# EAGLE design ESP32 (EAGLE 9.6.0)
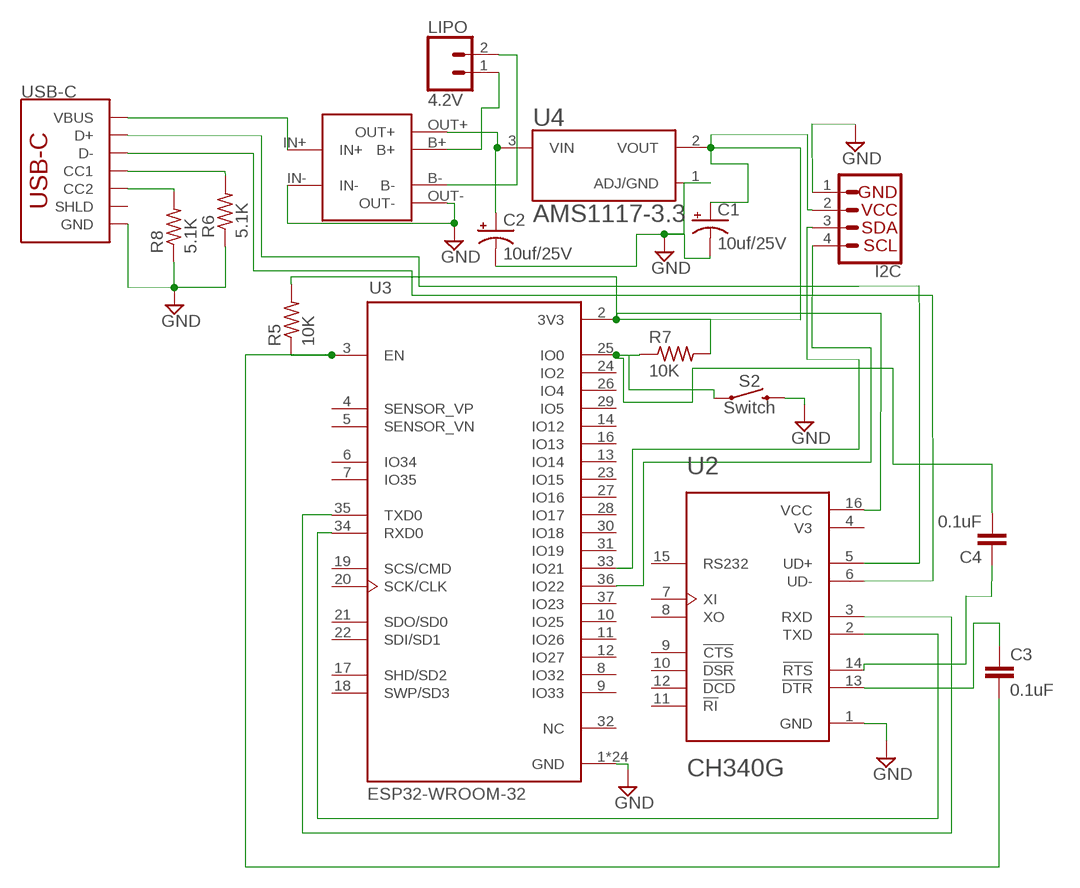
[diagram p0: schematic, sheet 1]

## Parts
C1  10uf/25V  1000UF-RADIAL-5MM-25V-20%-NO-SILK  [CPOL-RADIAL-5MM-10MM-NS]
C2  10uf/25V  1000UF-RADIAL-5MM-25V-20%-NO-SILK  [CPOL-RADIAL-5MM-10MM-NS]
C3  0.1uF  0.1UF-KIT-EZ-50V-20%  [CAP-PTH-SMALL-KIT]
C4  0.1uF  0.1UF-KIT-EZ-50V-20%  [CAP-PTH-SMALL-KIT]
I2C  I2C_STANDARD  [1X04]
LIPO  4.2V  CONN_02  [1X02]
R5  10K  R-US_0204/5  [0204/5]
R6  5.1K  R-US_0204/5  [0204/5]
R7  10K  R-US_0204/5  [0204/5]
R8  5.1K  R-US_0204/5  [0204/5]
S2  Switch  MOMENTARY-SWITCH-SPST-PTH-6.0MM  [TACTILE_SWITCH_PTH_6.0MM]
U1  TP4056  TP4056  [TP4056]
U2  CH340G  [SOIC127P600X180-16N]
U3  ESP32-WROOM-32  [MODULE_ESP32-WROOM-32]
U4  AMS1117-3.3  [SOT229P700X180-4N]
USB-C  USB_C_2-LAYER_PADS  [USB-C-16P-2LAYER-PADS]

## Nets
GND: C1.- C2.- I2C.1 R6.1 R8.1 S2.3 U1.IN- U1.OUT- U2.1(GND) U3.1(GND) U3.15(GND) U3.38(GND) U3.39_1(GND) U3.39_2(GND) U3.39_3(GND) U3.39_4(GND) U3.39_5(GND) U3.39_6(GND) U3.39_7(GND) U3.39_8(GND) U3.39_9(GND) U3.39_10(GND) U3.39_11(GND) U3.39_12(GND) U3.39_13(GND) U3.39_14(GND) U3.39_15(GND) U3.39_16(GND) U3.39_17(GND) U3.39_18(GND) U3.39_19(GND) U3.39_20(GND) U3.39_21(GND) U4.1(ADJ/GND) USB-C.GND USB-C.GND2(GND)
N$1: C1.+ I2C.2 R5.2 R7.2 U2.16(VCC) U3.2(3V3) U4.2(VOUT)
N$2: U1.IN+ USB-C.VBUS1(VBUS) USB-C.VBUS2(VBUS)
N$3: C2.+ U1.OUT+ U4.3(VIN)
N$4: U2.5(UD+) USB-C.A6(D+) USB-C.B6(D+)
N$5: U2.6(UD-) USB-C.A7(D-) USB-C.B7(D-)
N$6: U2.3(RXD) U3.35(TXD0)
N$7: U2.2(TXD) U3.34(RXD0)
N$8: C3.2 R5.1 U3.3(EN)
N$9: C4.2 R7.1 S2.1 U3.25(IO0)
N$10: I2C.3 U3.33(IO21)
N$11: I2C.4 U3.36(IO22)
N$12: C3.1 U2.13(!DTR)
N$13: C4.1 U2.14(!RTS)
N$14: LIPO.1 U1.B+
N$15: LIPO.2 U1.B-
N$16: R6.2 USB-C.A5(CC1)
N$17: R8.2 USB-C.B5(CC2)
Unconnected: U2.7(XI) U2.8(XO) U2.9(!CTS) U2.10(!DSR) U2.11(!RI) U2.12(!DCD) U2.15(RS232) U3.4(SENSOR_VP) U3.5(SENSOR_VN) U3.6(IO34) U3.7(IO35) U3.8(IO32) U3.9(IO33) U3.10(IO25) U3.11(IO26) U3.12(IO27) U3.13(IO14) U3.14(IO12) U3.16(IO13) U3.17(SHD/SD2) U3.18(SWP/SD3) U3.19(SCS/CMD) U3.20(SCK/CLK) U3.21(SDO/SD0) U3.22(SDI/SD1) U3.23(IO15) U3.24(IO2) U3.26(IO4) U3.27(IO16) U3.28(IO17) U3.29(IO5) U3.30(IO18) U3.31(IO19) U3.32(NC) U3.37(IO23) USB-C.SHLD1(SHLD) USB-C.SHLD2(SHLD) USB-C.SHLD3(SHLD) USB-C.SHLD4(SHLD)

## Power pins joined to a net without a drawn wire
V3: U2.4(V3)

## Library data of the parts
C1 C2 = SparkFun-Capacitors:1000UF: 1,000µF/1mF ceramic capacitors A capacitor is a passive two-terminal electrical component used to store electrical energy temporarily in an electric field. CAP-08070; OC_FARNELL: unknown
C3 C4 = SparkFun-Capacitors:0.1UF: 0.1µF ceramic capacitors A capacitor is a passive two-terminal electrical component used to store electrical energy temporarily in an electric field.; MF: VISHAY; MPN: 20VLP10-R; OC_FARNELL: 2860003; PROD_ID: CAP-08370
I2C = SparkFun-Connectors:I2C_STANDARD: SparkFun I2C Standard Pinout Header SparkFun has standardized on a pinout for all I2C based sensor breakouts. This pinout allows I2C boards to be plugged directly into the headers on Arduino Uno compatible boards, and to be daisy chained easily. Example SparkFun Products: SparkFun Atmospheric Sensor Breakout - BME280 <https://www.sparkfun.com/products/13676> SparkFun Altitude/Pressure Sensor Breakout - MPL3115A2 <https://www.sparkfun.com/products/11084> SparkFun TOF Range Finder Sensor - VL6180 <https://www.sparkfun.com/products/12785>; OC_FARNELL: unknown
LIPO = SparkFun-Connectors:CONN_02: Multi connection point. Often used as Generic Header-pin footprint for 0.1 inch spaced/style header connections On any of the 0.1 inch spaced packages, you can populate with these: Break Away Headers - Straight <https://www.sparkfun.com/products/116> (PRT-00116) Break Away Male Headers - Right Angle <https://www.sparkfun.com/products/553> (PRT-00553) Female Headers <https://www.sparkfun.com/products/115> (PRT-00115) Break Away Headers - Machine Pin <https://www.sparkfun.com/products/117> (PRT-00117) Break Away Female Headers - Swiss Machine Pin <https://www.sparkfun.com/products/743> (PRT-00743) For SCREWTERMINALS and SPRING TERMINALS visit here: Screw Terimnals on SparkFun.com <https://www.sparkfun.com/search/results?term=Screw+Terminals> (5mm/3.5mm/2.54mm spacing) This device is also useful as a general connection point to wire up your design to another part of your project. Our various solder wires solder well into these plated through hole pads. Hook-Up Wire - Assortment (Stranded, 22 AWG) <https://www.sparkfun.com/products/11375> (PRT-11375) Hook-Up Wire - Assortment (Solid Core, 22 AWG) <https://www.sparkfun.com/products/11367> (PRT-11367) View the entire wire category on our website here <https://www.sparkfun.com/categories/141> Special notes: Molex polarized connector foot print use with: PRT-08233 with associated crimp pins and housings. 2.54_SCREWTERM for use with PRT-10571. 3.5mm Screw Terminal footprints for PRT-08084 5mm Screw Terminal footprints for use with PRT-08432; OC_FARNELL: unknown
R5 R7 = rcl:R-US_: RESISTOR, American symbol; MF: TT ELECTRONICS / WELWYN; MPN: WP4S-10KRJA2; OC_FARNELL: 1219304; SPICEPREFIX: R
R6 R8 = rcl:R-US_: RESISTOR, American symbol; MF: NEOHM - TE CONNECTIVITY; MPN: LR2F5K1; OC_FARNELL: 2330356; SPICEPREFIX: R
S2 = SparkFun-Switches:MOMENTARY-SWITCH-SPST: Momentary Switch (Pushbutton) - SPST Normally-open (NO) SPST momentary switches (buttons, pushbuttons). Variants PTH-12MM - 12mm square, through-hole Momentary Pushbutton Switch - 12mm Square <https://www.sparkfun.com/products/9190> (COM-09190) PTH-6.0MM, PTH-6.0MM-KIT - 6.0mm square, through-hole Mini Pushbutton Switch <https://www.sparkfun.com/products/97> (COM-00097) KIT package intended for soldering kit's - only one side of pads' copper is exposed. PTH-RIGHT-ANGLE-KIT - Right-angle, through-hole Right Angle Tactile Button <https://www.sparkfun.com/products/10791> - Used on SparkFun BigTime Watch Kit <https://www.sparkfun.com/products/11734> SMD-12MM - 12mm square, surface-mount Tactile Button - SMD (12mm) <https://www.sparkfun.com/products/12993> (COM-12993) Used on SparkFun PicoBoard <https://www.sparkfun.com/products/11888> SMD-4.5MM - 4.5mm Square Trackball Switch Used on SparkFun Blackberry Trackballer Breakout <https://www.sparkfun.com/products/13169> SMD-4.6MMX2.8MM - 4.60mm x 2.80mm, surface mount Used on SparkFun Pro Micro - RP2040 <https://www.sparkfun.com/products/17717> SMD-5.2MM, SMD-5.2-REDUNDANT - 5.2mm square, surface-mount Mini Pushbutton Switch - SMD <https://www.sparkfun.com/products/8720> (COM-08720) Used on Arduino Pro Mini <https://www.sparkfun.com/products/11114> REDUNDANT package connects both switch circuits together SMD-6.0X3.5MM - 6.0 x 3.5mm, surface mount Momentary Reset Switch SMD <https://www.sparkfun.com/products/8229> (COM-08229) SMD-6.2MM-TALL - 6.2mm square, surface mount Tactile Button - SMD (6mm) <https://www.sparkfun.com/products/12992> Used on SparkFun Digital Sandbox <https://www.sparkfun.com/products/12651> SMD-RIGHT-ANGLE - Right-angle, surface mount Used on SparkFun Block for Intel® Edison - Arduino <https://www.sparkfun.com/products/13036>; MF: ALCOSWITCH - TE CONNECTIVITY; MPN: FSM10JH; OC_FARNELL: 1555986; PROD_ID: SWCH-08441; SF_SKU: COM-00097
U1 = 32teeth - TP4056 Module:TP4056; OC_FARNELL: unknown; SPICEPREFIX: X
U2 = CH340G (1):CH340G: Check availability <https://pricing.snapeda.com/parts/Ch340G/WCH/view-part?ref=eda>; AVAILABILITY: Not in stock; CHECK_PRICES: https://www.snapeda.com/parts/Ch340G/WCH/view-part/?ref=eda; DESCRIPTION: USB Interface Integrated Circuit; MF: WCH; MP: Ch340G; OC_FARNELL: unknown; PACKAGE: None; PRICE: None; SNAPEDA_LINK: https://www.snapeda.com/parts/Ch340G/WCH/view-part/?ref=snap
U3 = ESP32-WROOM-32:ESP32-WROOM-32: Check availability <https://pricing.snapeda.com/parts/ESP32-WROOM-32/Espressif%20Systems/view-part?ref=eda>; AVAILABILITY: In Stock; CHECK_PRICES: https://www.snapeda.com/parts/ESP32-WROOM-32/Espressif+Systems/view-part/?ref=eda; DESCRIPTION: Bluetooth, WiFi 802.11b/g/n, Bluetooth v4.2 +EDR, Class 1, 2 and 3 Transceiver Module 2.4GHz ~ 2.5GHz Antenna Not Included, U.FL Surface Mount; MF: DFROBOT; MP: ESP32-WROOM-32; MPN: DFR0654; OC_FARNELL: 4308187; PACKAGE: None; PRICE: None; SNAPEDA_LINK: https://www.snapeda.com/parts/ESP32-WROOM-32/Espressif+Systems/view-part/?ref=snap
U4 = AMS1117-3.3:AMS1117-3.3: Sot223/Pkg 1-Amp 3.3-Volt Low Drop Out Voltage Regulatator; AVAILABILITY: Unavailable; DESCRIPTION: Sot223/Pkg 1-Amp 3.3-Volt Low Drop Out Voltage Regulatator; MF: Advanced Monolithic Systems; MP: AMS1117-3.3; OC_FARNELL: unknown; PACKAGE: None; PRICE: None
USB-C = SparkFun-Connectors:USB_C: USB Type C 16Pin Connector Super Speed pins not available on the 16-pin purely SMD connector so this part is best for USB 2.0 implementations. D1 and D2 are tied together enabling D+/- no matter which way the cable is plugged into the connector. The two channel configuration pins (CC1/2) are exposed. These are normally connected to ground via 5.1k resistors but can be reconfigured for high current/high power applications. **4-LAYER BOARD WARNING!!** If designing 4-layer board, make sure to select the variant _4-LAYER-ISOLATED. The linked footprint (USB-C-16-4LAYER-ISOLATED) includes some very necessary cutout polygons in the inner layers (2 and 15). This prevents the PTH mounting shield legs on the USB connector from electrically connecting any other polygons on the inner layers (usually VCC and GND).; MF: MOLEX; MPN: 105450-0101; OC_FARNELL: 2524076; PROD_ID: CONN-14122

## Board
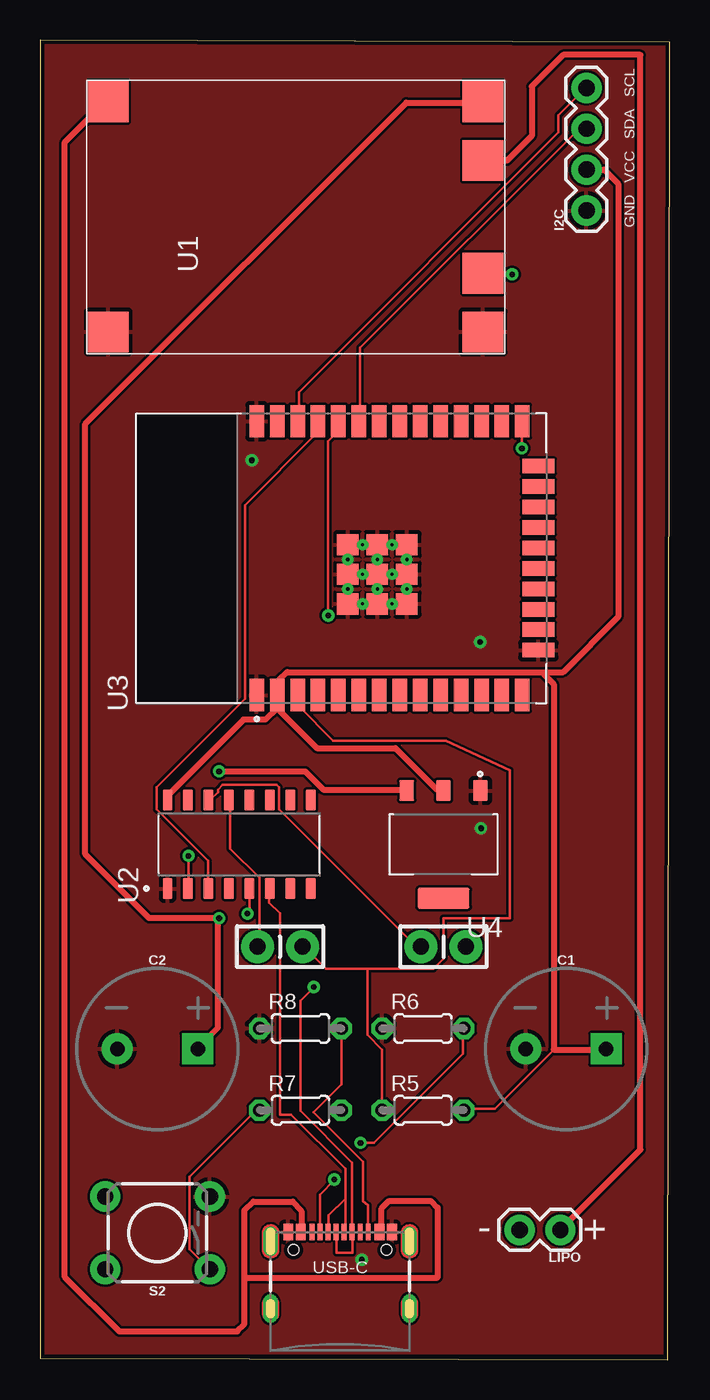
[diagram p1: board, top side]
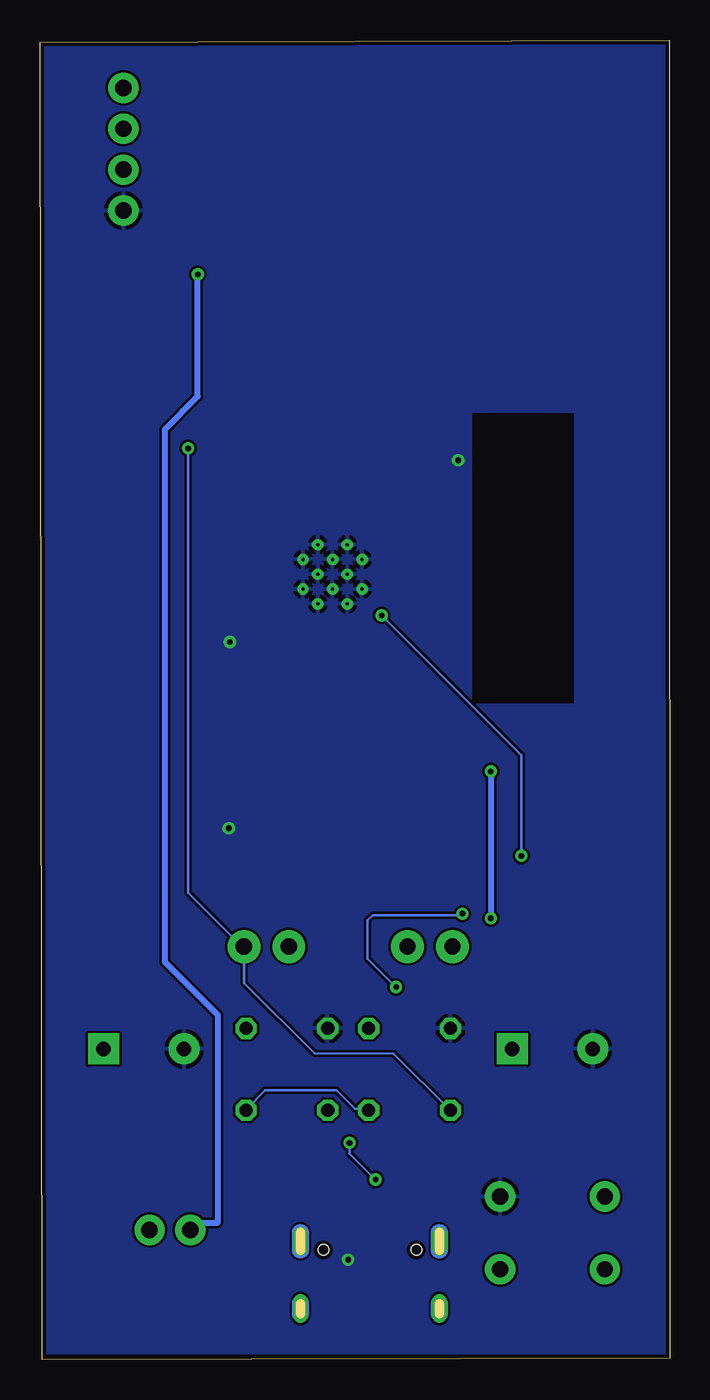
[diagram p2: board, bottom side, seen from below]

Size 39.13 x 81.96 mm. Coordinates in mm from the lower left corner, seen from the top.
Outline: 0,0.09 39,0 39.13,81.83 0.01,81.96 0,0.09
Copper layers (1*16): Top 0.035mm / dielectric 1.5mm / Bottom 0.035mm
Design rules "default *": minimum track width 6mil, minimum drill 0.2mm, track to track 6mil, track to pad 6mil, pad to pad 6mil, via to via 6mil, smd to smd 6mil, copper to edge 10mil, drill to drill 6mil, minimum pad ring 10mil, minimum via ring 8mil, stop-mask expansion 4mil, vias tented up to drill 0mil, thermal gap 10mil

### Footprints (pad centres in the part's own frame; a part is rotated, then mirrored left to right if it is on the bottom)
CPOL-RADIAL-5MM-10MM-NS = drill 0.9 pad 1.93 square: + 2.5,0 | drill 0.9 pad 1.93: - -2.5,0
CAP-PTH-SMALL-KIT = drill 1.016 pad 2.032: 1 -1.397,0; 2 1.397,0
1X04 = drill 1.016 pad 1.88: 1 0,0; 2 2.54,0; 3 5.08,0; 4 7.62,0
1X02 = drill 1.016 pad 1.88: 1 0,0; 2 2.54,0
0204/5 = drill 0.813 octagon: 1 -2.54,0; 2 2.54,0
TACTILE_SWITCH_PTH_6.0MM = drill 1.016 pad 1.88: 1 -3.251,2.261; 2 3.251,2.261; 3 -3.251,-2.261; 4 3.251,-2.261
TP4056 = smd 2.54 x 2.54: B+ 12,1.35; B- 5,1.35; IN+ 15.65,24.65; IN- 1.35,24.65; OUT+ 15.65,1.35; OUT- 1.35,1.35
SOIC127P600X180-16N = smd 1.31 x 0.62: 1 -2.75,4.445; 2 -2.75,3.175; 3 -2.75,1.905; 4 -2.75,0.635; 5 -2.75,-0.635; 6 -2.75,-1.905; 7 -2.75,-3.175; 8 -2.75,-4.445; 9 2.75,-4.445; 10 2.75,-3.175; 11 2.75,-1.905; 12 2.75,-0.635; 13 2.75,0.635; 14 2.75,1.905; 15 2.75,3.175; 16 2.75,4.445
MODULE_ESP32-WROOM-32 = smd 2 x 0.9: 1 -8.5,5.26; 2 -8.5,3.99; 3 -8.5,2.72; 4 -8.5,1.45; 5 -8.5,0.18; 6 -8.5,-1.09; 7 -8.5,-2.36; 8 -8.5,-3.63; 9 -8.5,-4.9; 10 -8.5,-6.17; 11 -8.5,-7.44; 12 -8.5,-8.71; 13 -8.5,-9.98; 14 -8.5,-11.25; 25 8.5,-11.25; 26 8.5,-9.98; 27 8.5,-8.71; 28 8.5,-7.44; 29 8.5,-6.17; 30 8.5,-4.9; 31 8.5,-3.63; 32 8.5,-2.36; 33 8.5,-1.09; 34 8.5,0.18; 35 8.5,1.45; 36 8.5,2.72; 37 8.5,3.99; 38 8.5,5.26 | smd 0.9 x 2: 15 -5.715,-12.25; 16 -4.445,-12.25; 17 -3.175,-12.25; 18 -1.905,-12.25; 19 -0.635,-12.25; 20 0.635,-12.25; 21 1.905,-12.25; 22 3.175,-12.25; 23 4.445,-12.25; 24 5.715,-12.25 | smd 1.33 x 1.33: 39_1 -2.835,-0.405; 39_2 -1,-0.405; 39_3 0.835,-0.405; 39_4 -2.835,-2.24; 39_5 -1,-2.24; 39_6 0.835,-2.24; 39_7 -2.835,-4.075; 39_8 -1,-4.075; 39_9 0.835,-4.075 | drill 0.2 pad 0.3: 39_10 -1.917,-0.405; 39_11 -0.083,-0.405; 39_12 -2.835,-1.323; 39_13 -1,-1.323; 39_14 0.835,-1.323; 39_15 -1.917,-2.24; 39_16 -0.083,-2.24; 39_17 -2.835,-3.158; 39_18 -1,-3.158; 39_19 0.835,-3.158; 39_20 -1.917,-4.075; 39_21 -0.083,-4.075
SOT229P700X180-4N = smd 0.93 x 1.31: 1 -2.29,-3.345; 2 0,-3.345; 3 2.29,-3.345 | smd 3.24 x 1.31: 4 0,3.345
USB-C-16P-2LAYER-PADS = smd 0.3 x 1: A5 -1.25,-0.34; A6 -0.25,-0.34; A7 0.25,-0.34; A8 1.25,-0.34; B5 1.75,-0.34; B6 0.75,-0.34; B7 -0.75,-0.34; B8 -1.75,-0.34 | smd 0.6 x 1: GND -3.225,-0.34; GND2 3.225,-0.34; VBUS1 -2.45,-0.34; VBUS2 2.45,-0.34 | drill 0.4 pad 0.6 long: SHLD1 -4.318,-0.915; SHLD2 4.318,-0.915; SHLD3 -4.318,-5.095; SHLD4 4.318,-5.095 | hole 0.65: -2.89,-1.445; 2.89,-1.445

### Placement (x,y rotation side)
C1  32.68,19.31 0 top
C2  7.28,19.31 0 top
C3  14.9,25.66 0 top
C4  25.06,25.66 0 top
I2C  33.95,71.38 90 top
LIPO  32.33,8.07 180 top
R5  23.79,15.5 0 top
R6  23.79,20.58 0 top
R7  16.17,15.5 0 top
R8  16.17,20.58 0 top
S2  7.28,7.88 180 top
U1  28.87,62.49 90 top
U2  12.36,32.01 90 top
U3  18.71,49.79 90 top
U4  25.06,32.01 180 top
USB-C  18.64,8.27 0 top

### Tracks (layer width: path | path; a pad name or v marks a point on that pad's centre or on a via)
GND  (via drill 0.35)
  other vias: 13.15,55.87 27.34,44.58 19.99,6.22 27.4,33.01
  pour Top: -1.13,82.24 -1.13,0.41 40.77,0.41 40.77,82.24
  pour Bottom: -1.15,82.24 -1.15,0.39 40.78,0.39 40.78,82.24
N$1
  Top 0.152: 31.92,19.26 28.26,15.6 26.44,15.6 R5.2 | 35.12,19.26 C1.+ | U3.2 14.7,41.2 14.7,40.75 U3.2 | 25.06,35.41 U4.2 | 31.31,42.58 31.46,42.72 | 14.85,42.23 14.85,41.36 U3.2
  Top 0.381: 35.12,19.26 31.92,19.26 31.92,41.97 31.31,42.58 | U2.16 7.92,35.04 12.64,39.76 13.99,39.76 14.71,40.48 | 14.71,40.48 14.84,40.61 14.7,40.75 | 25.06,35.41 24.65,35.41 22.07,37.99 17.19,37.99 14.71,40.48 | I2C.2 35.05,73.92 35.93,73.04 35.93,46.14 32.51,42.72 31.46,42.72 15.34,42.72 14.85,42.23
  Bottom 0.152: R7.2 18.82,15.6 19.55,15.6 20.7,16.75 25.14,16.75 26.28,15.6 R5.2
N$2
  Top 0.152: 4.04,78.14 U1.IN+
  Top 0.381: 4.04,78.14 1.54,75.64 1.54,5.14 4.92,1.76 12.24,1.76 12.69,2.21 12.69,5.07 12.7,5.07 | 16.25,7.87 USB-C.VBUS1 16.24,7.98 16.24,9.23 15.69,9.82 13.25,9.82 12.7,9.27 12.7,6.58 12.7,5.07 | USB-C.VBUS2 21.22,8.07 21.22,9.4 21.69,9.86 24.28,9.86 24.7,9.45 24.7,5.14 24.64,5.07 13.21,5.07 12.7,5.07
N$3  (via drill 0.35)
  Top 0.152: 22.63,35.41 U4.3 | 9.82,19.41 C2.+ | 27.5,78.09 U1.OUT+
  Top 0.381: 22.63,35.41 17.6,35.41 16.46,36.55 v11.12,36.55 | 11.04,27.44 11.04,20.63 9.82,19.41 | 27.5,78.09 22.76,78.09 2.8,58.13 2.8,31.39 6.76,27.44 11.04,27.44 | 11.04,27.44 11.06,27.42 v11.12,27.42
  Bottom 0.381: v11.12,36.55 v11.12,27.42 11.08,27.38
N$4  (via drill 0.35)
  Top 0.152: 13.02,29.16 U2.5 13,27.83 v12.88,27.71 | USB-C.A6 18.4,7.92 18.4,6.67 18.42,6.65 19.41,6.65 19.41,7.91 USB-C.B6 19.39,12.25 16.17,15.47 16.17,22.31 v17.01,23.15 | v17.01,23.15
  Bottom 0.152: v17.01,23.15 18.78,24.92 18.78,27.29 18.44,27.62 12.98,27.62 v12.88,27.71
N$5
  Top 0.152: U2.6 14.24,29.23 14.24,28.37 14.89,27.72 14.89,15.23 15.6,15.23 18.97,11.86 18.97,10.01 18.96,10.01 | 18.96,10.01 18.96,8 18.9,7.93 USB-C.A7 | 18.96,10.01 17.93,8.97 17.93,7.97 USB-C.B7
N$6
  Top 0.152: U2.3 10.43,29.32 10.43,30.99 7.23,34.19 7.23,35.57 12.72,41.05 12.72,53.09 17.14,57.51 17.14,58.27 U3.35
N$7  (via drill 0.35)
  Top 0.152: v9.21,31.3 9.21,29.32 U2.2 | v17.9,46.23 17.9,57.05 18.51,57.66 18.51,58.27 U3.34
  Bottom 0.152: v9.21,31.3 9.21,37.55 v17.9,46.23
N$8
  Top 0.152: 20.34,24.29 17.75,24.29 16.38,25.66 C3.2 | 20.34,24.29 24.44,24.29 25.08,24.93 25.06,27.42 29.19,27.43 29.21,36.62 25.22,38.46 18.21,38.46 16.07,40.59 16.07,41.2 U3.3 | R5.1 21.25,19.26 20.34,20.17 20.34,24.29
N$9  (via drill 0.35)
  Top 0.152: R7.1 13.43,15.5 9.29,11.36 9.29,6.87 S2.1 | v29.94,56.61 29.94,58.27 U3.25
  Bottom 0.152: v29.94,56.61 29.94,29.01 26.59,25.66 C4.2 26.46,23.4 22.09,19.03 17.16,19.02 R7.1
N$10
  Top 0.152: U3.33 19.88,58.43 19.88,62.85 33.45,76.41 33.9,76.41 I2C.3
N$11
  Top 0.152: U3.36 16.07,58.43 16.07,60.1 32.22,76.25 32.22,77.31 33.9,79 I2C.4
N$12
  Top 0.152: U2.13 11.81,34.65 11.81,31.76 13.63,29.93 13.63,25.66 C3.1
N$13
  Top 0.152: C4.1 23.39,25.66 14.85,34.19 14.85,35.57 14.7,35.72 11.35,35.72 11.04,35.41 11.04,35.26 10.59,34.8 U2.14
N$14
  Top 0.381: LIPO.1 37.31,13.05 37.31,81.05 32.5,81.05 30.55,79.1 30.55,76.02 29.02,74.49 U1.B+
N$15  (via drill 0.35)
  Top 0.152: 27.66,67.42 U1.B-
  Top 0.381: v29.33,67.42 27.66,67.42
  Bottom 0.381: v29.33,67.42 29.33,59.83 31.37,57.8 31.37,24.69 28.07,21.4 28.07,8.51 29.34,8.51 LIPO.2
N$16  (via drill 0.35)
  Top 0.152: v19.91,13.47 20.75,13.47 26.28,19 26.28,20.48 R6.2 | USB-C.A5 17.39,10.26 18.31,11.18 v18.29,11.19 v18.28,11.19
  Bottom 0.152: v18.28,11.19 19.89,12.8 19.89,13.47 v19.91,13.47
N$17
  Top 0.152: USB-C.B5 20.39,9.6 20.05,9.83 20.05,12.29 16.98,15.37 18.71,17.11 R8.2

### Text on the board
tPlace: GND VCC SDA SCL | - | +